# Altium schematic sheet [02] - BLOCK DIAGRAM.SchDoc
size A3; DocumentNumber: 2; SheetNumber: 2; SheetTotal: 9
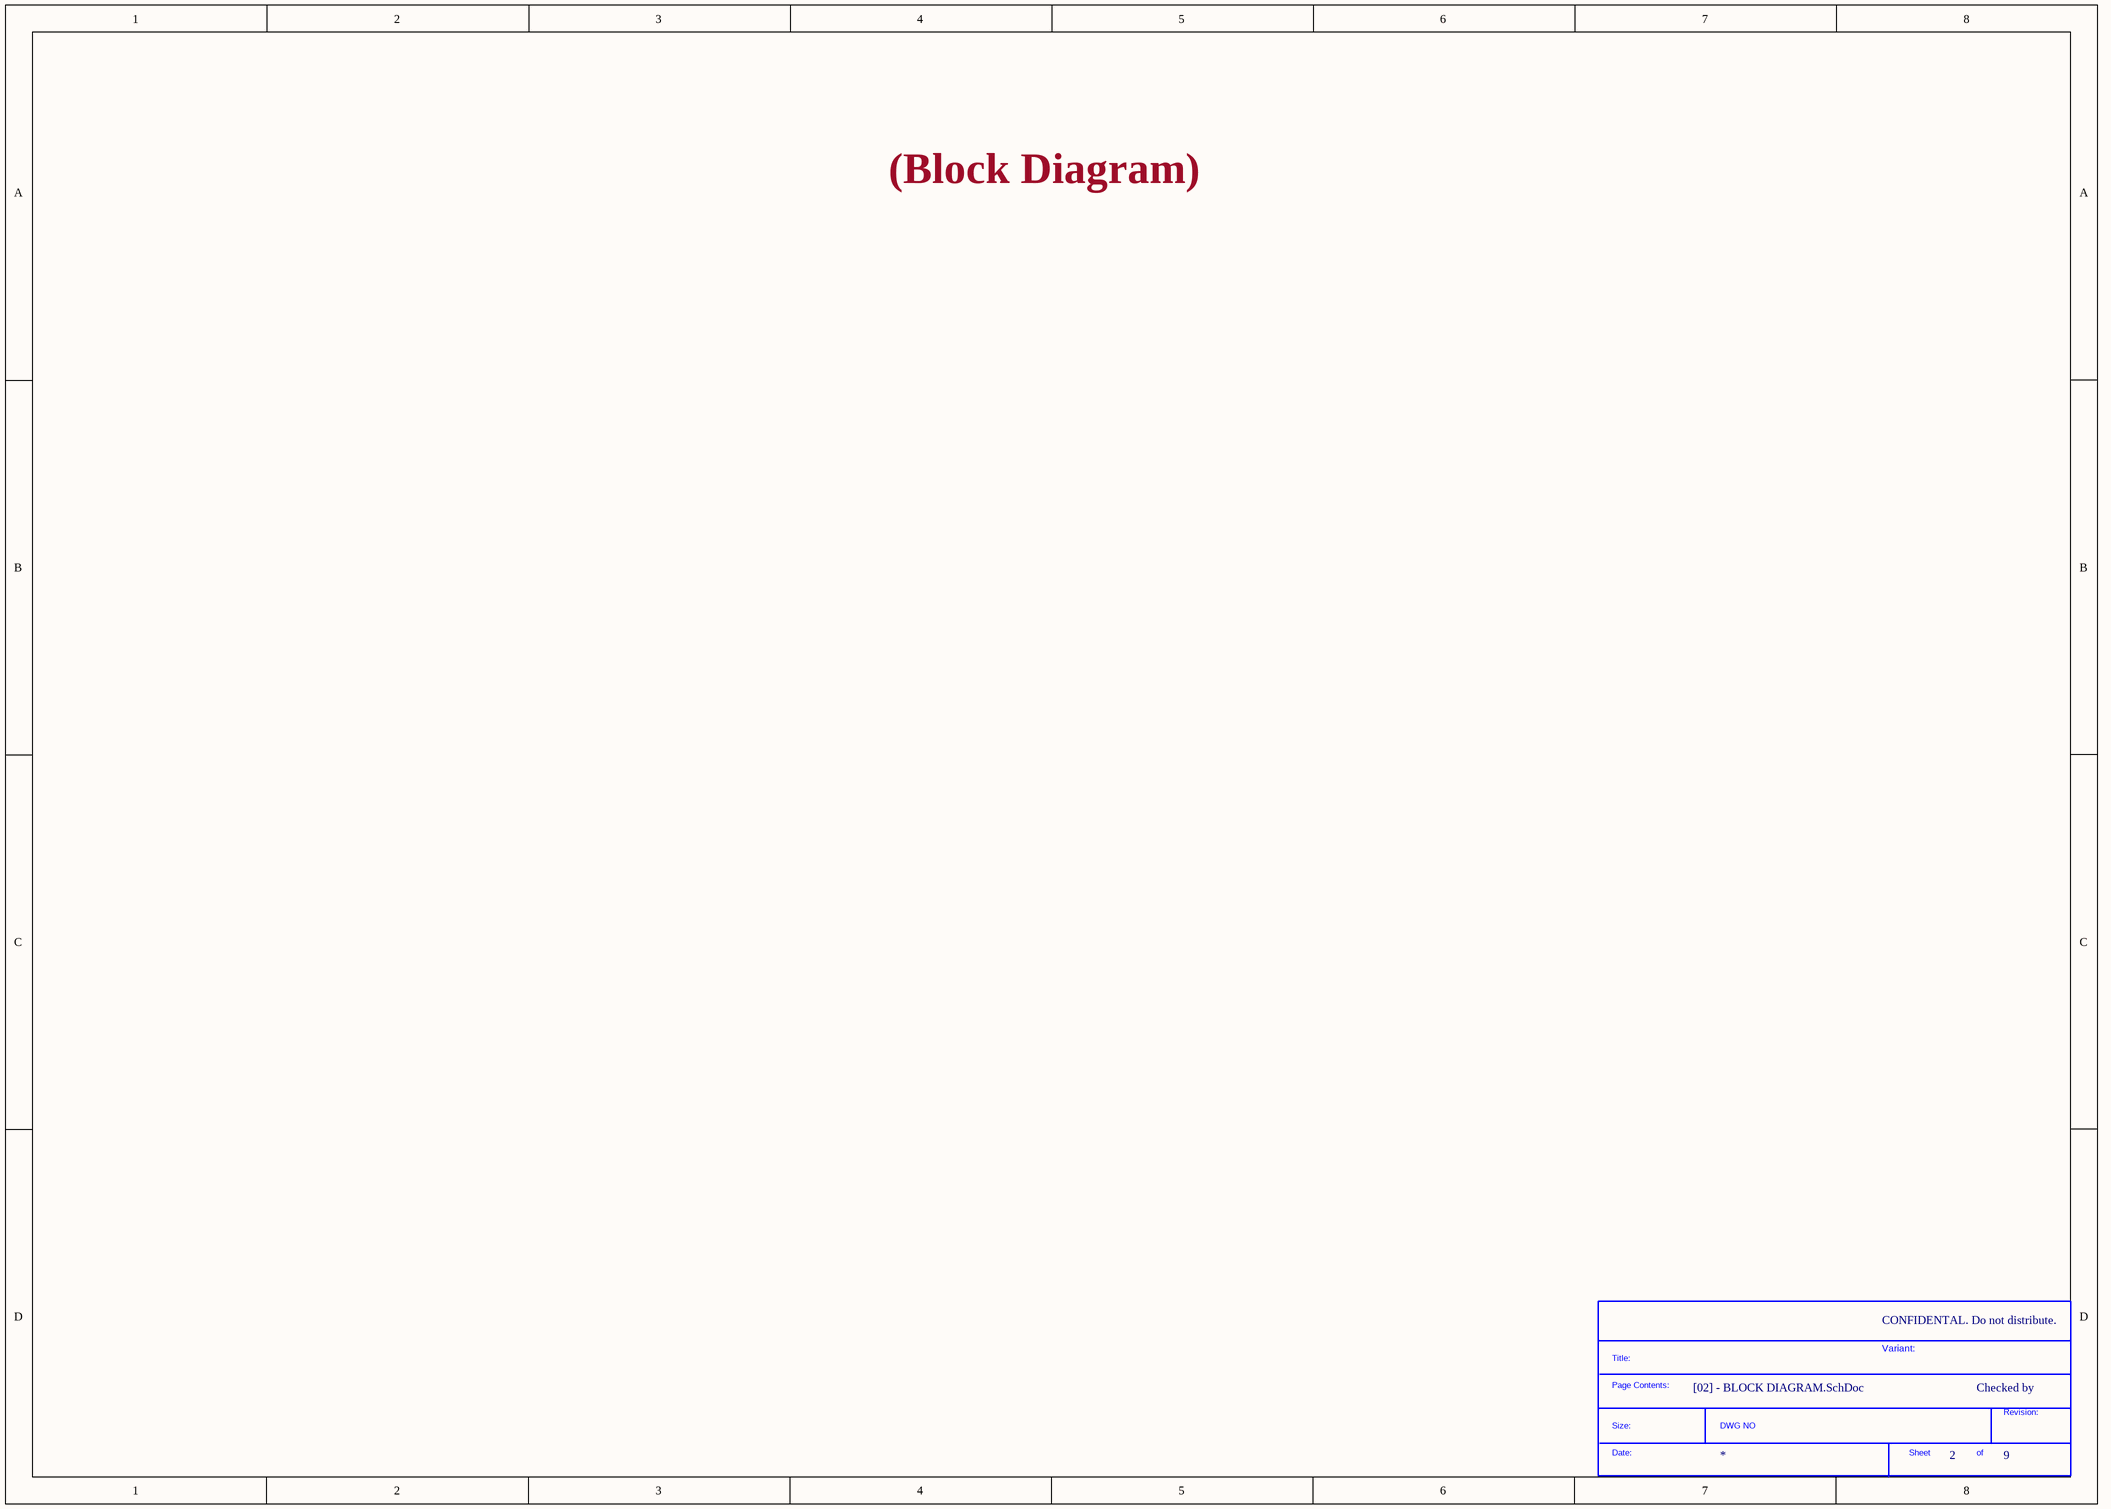
[diagram p0: [02] - BLOCK DIAGRAM.SchDoc]

## Parts
*  SDTitleBlock  (value not drawn)  (graphical)

## Notes on the sheet
- (Block Diagram)
- CONFIDENTAL. Do not distribute.
- CLOCKS (CPU & PCIE)
- Variant:
- Checked by
- (in symbol SDTitleBlock) Title:; Page Contents:; Revision:; Size:; DWG NO; Date:; Sheet; of